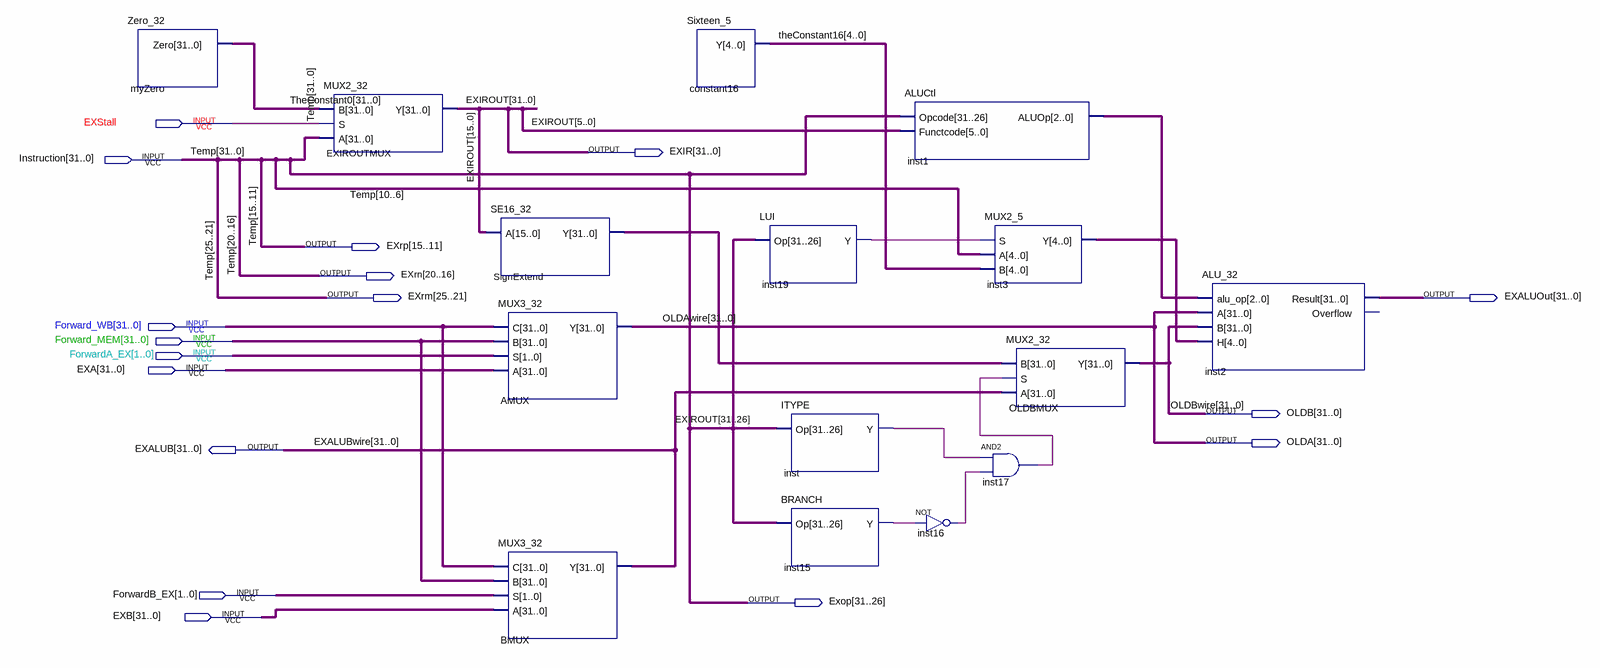
[diagram p0: schematic sheet]
// Quartus schematic EX.bdf as structural Verilog: 15 symbols, 17 pins
module EX (
  input  EXStall,
  input  [31:0] Instruction,
  input  [31:0] Forward_WB,
  input  [31:0] Forward_MEM,
  input  [1:0] ForwardA_EX,
  input  [31:0] EXA,
  input  [1:0] ForwardB_EX,
  input  [31:0] EXB,
  output [31:0] EXIR,
  output [15:11] EXrp,
  output [20:16] EXrn,
  output [25:21] EXrm,
  output [31:0] EXALUOut,
  output [31:0] OLDB,
  output [31:0] OLDA,
  output [31:0] EXALUB,
  output [31:26] Exop
);

  wire inst15_y, inst16_out, inst17_out, inst19_y, inst_y;
  wire [2:0] inst1_aluop;
  wire [4:0] inst3_y, theConstant16;
  wire [31:0] SignExtend_y, TheConstant0;

  Zero_32 myZero (.Zero(TheConstant0));
  MUX2_32 EXIROUTMUX (.B(TheConstant0), .S(EXStall), .A(Instruction), .Y(EXIR));
  SE16_32 SignExtend (.A(EXIR[15:0]), .Y(SignExtend_y));
  MUX3_32 AMUX (.C(Forward_WB), .B(Forward_MEM), .S(ForwardA_EX), .A(EXA), .Y(OLDA));
  MUX3_32 BMUX (.C(Forward_WB), .B(Forward_MEM), .S(ForwardB_EX), .A(EXB), .Y(EXALUB));
  Sixteen_5 constant16 (.Y(theConstant16));
  LUI inst19 (.Op(EXIR[31:26]), .Y(inst19_y));
  ITYPE inst (.Op(EXIR[31:26]), .Y(inst_y));
  BRANCH inst15 (.Op(EXIR[31:26]), .Y(inst15_y));
  ALUCtl inst1 (.Opcode(Instruction), .Functcode(EXIR[5:0]), .ALUOp(inst1_aluop));
  not inst16 (inst16_out, inst15_y);
  MUX2_5 inst3 (.S(inst19_y), .A(Instruction[10:6]), .B(theConstant16), .Y(inst3_y));
  MUX2_32 OLDBMUX (.B(SignExtend_y), .S(inst17_out), .A(EXALUB), .Y(OLDB));
  and inst17 (inst17_out, inst_y, inst16_out);
  ALU_32 inst2 (.alu_op(inst1_aluop), .A(OLDA), .B(OLDB), .H(inst3_y), .Result(EXALUOut));  // open: Overflow

  assign Exop = EXIR[31:26];
  assign EXrm = Instruction[25:21];
  assign EXrn = Instruction[20:16];
  assign EXrp = Instruction[15:11];

  // Other names for the same wires on the sheet: EXALUBwire[31:0] = EXALUB; EXIROUT[31:0] = EXIR;
  //   Temp[31:0] = Instruction; OLDAwire[31:0] = OLDA; OLDBwire[31:0] = OLDB
endmodule
